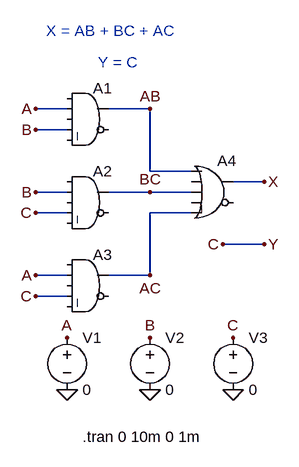
[diagram p0: schematic Exercise1.asc]
Exercise1.asc, the LTspice schematic file:
Version 4
SHEET 1 880 680
WIRE 160 80 112 80
WIRE 288 80 224 80
WIRE 160 112 112 112
WIRE 288 176 288 80
WIRE 352 176 288 176
WIRE 464 192 416 192
WIRE 160 208 112 208
WIRE 288 208 224 208
WIRE 352 208 288 208
WIRE 160 240 112 240
WIRE 352 240 288 240
WIRE 464 288 400 288
WIRE 160 336 112 336
WIRE 288 336 288 240
WIRE 288 336 224 336
WIRE 160 368 112 368
FLAG 160 512 0
FLAG 288 512 0
FLAG 416 512 0
FLAG 160 432 A
FLAG 288 432 B
FLAG 416 432 C
FLAG 112 80 A
FLAG 112 112 B
FLAG 112 208 B
FLAG 112 240 C
FLAG 112 336 A
FLAG 112 368 C
FLAG 288 80 AB
FLAG 288 336 AC
FLAG 288 208 BC
FLAG 464 192 X
FLAG 464 288 Y
FLAG 400 288 C
SYMBOL Digital\\and 192 32 R0
SYMATTR InstName A1
SYMATTR SpiceLine vhigh=5V
SYMBOL Digital\\and 192 160 R0
SYMATTR InstName A2
SYMATTR SpiceLine vhigh=5V
SYMBOL Digital\\and 192 288 R0
SYMATTR InstName A3
SYMATTR SpiceLine vhigh=5V
SYMBOL Digital\\or 384 144 R0
SYMATTR InstName A4
SYMATTR SpiceLine vhigh=5V
SYMBOL voltage 160 416 R0
WINDOW 123 0 0 Left 0
WINDOW 39 0 0 Left 0
SYMATTR InstName V1
SYMATTR Value 0
SYMBOL voltage 288 416 R0
WINDOW 123 0 0 Left 0
WINDOW 39 0 0 Left 0
SYMATTR InstName V2
SYMATTR Value 0
SYMBOL voltage 416 416 R0
WINDOW 123 0 0 Left 0
WINDOW 39 0 0 Left 0
SYMATTR InstName V3
SYMATTR Value 0
TEXT 184 584 Left 2 !.tran 0 10m 0 1m
TEXT 128 -40 Left 2 ;X = AB + BC + AC
TEXT 208 8 Left 2 ;Y = C

The netlist it stands for:
* Exercise1.asc
A1 0 A 0 B 0 0 AB 0 AND vhigh=5V
A2 0 B 0 Y 0 0 BC 0 AND vhigh=5V
A3 0 A 0 Y 0 0 AC 0 AND vhigh=5V
A4 AB 0 BC 0 AC 0 X 0 OR vhigh=5V
V1 A 0 0
V2 B 0 0
V3 Y 0 0
.tran 0 10m 0 1m
* X = AB + BC + AC
* Y = C
.backanno
.end